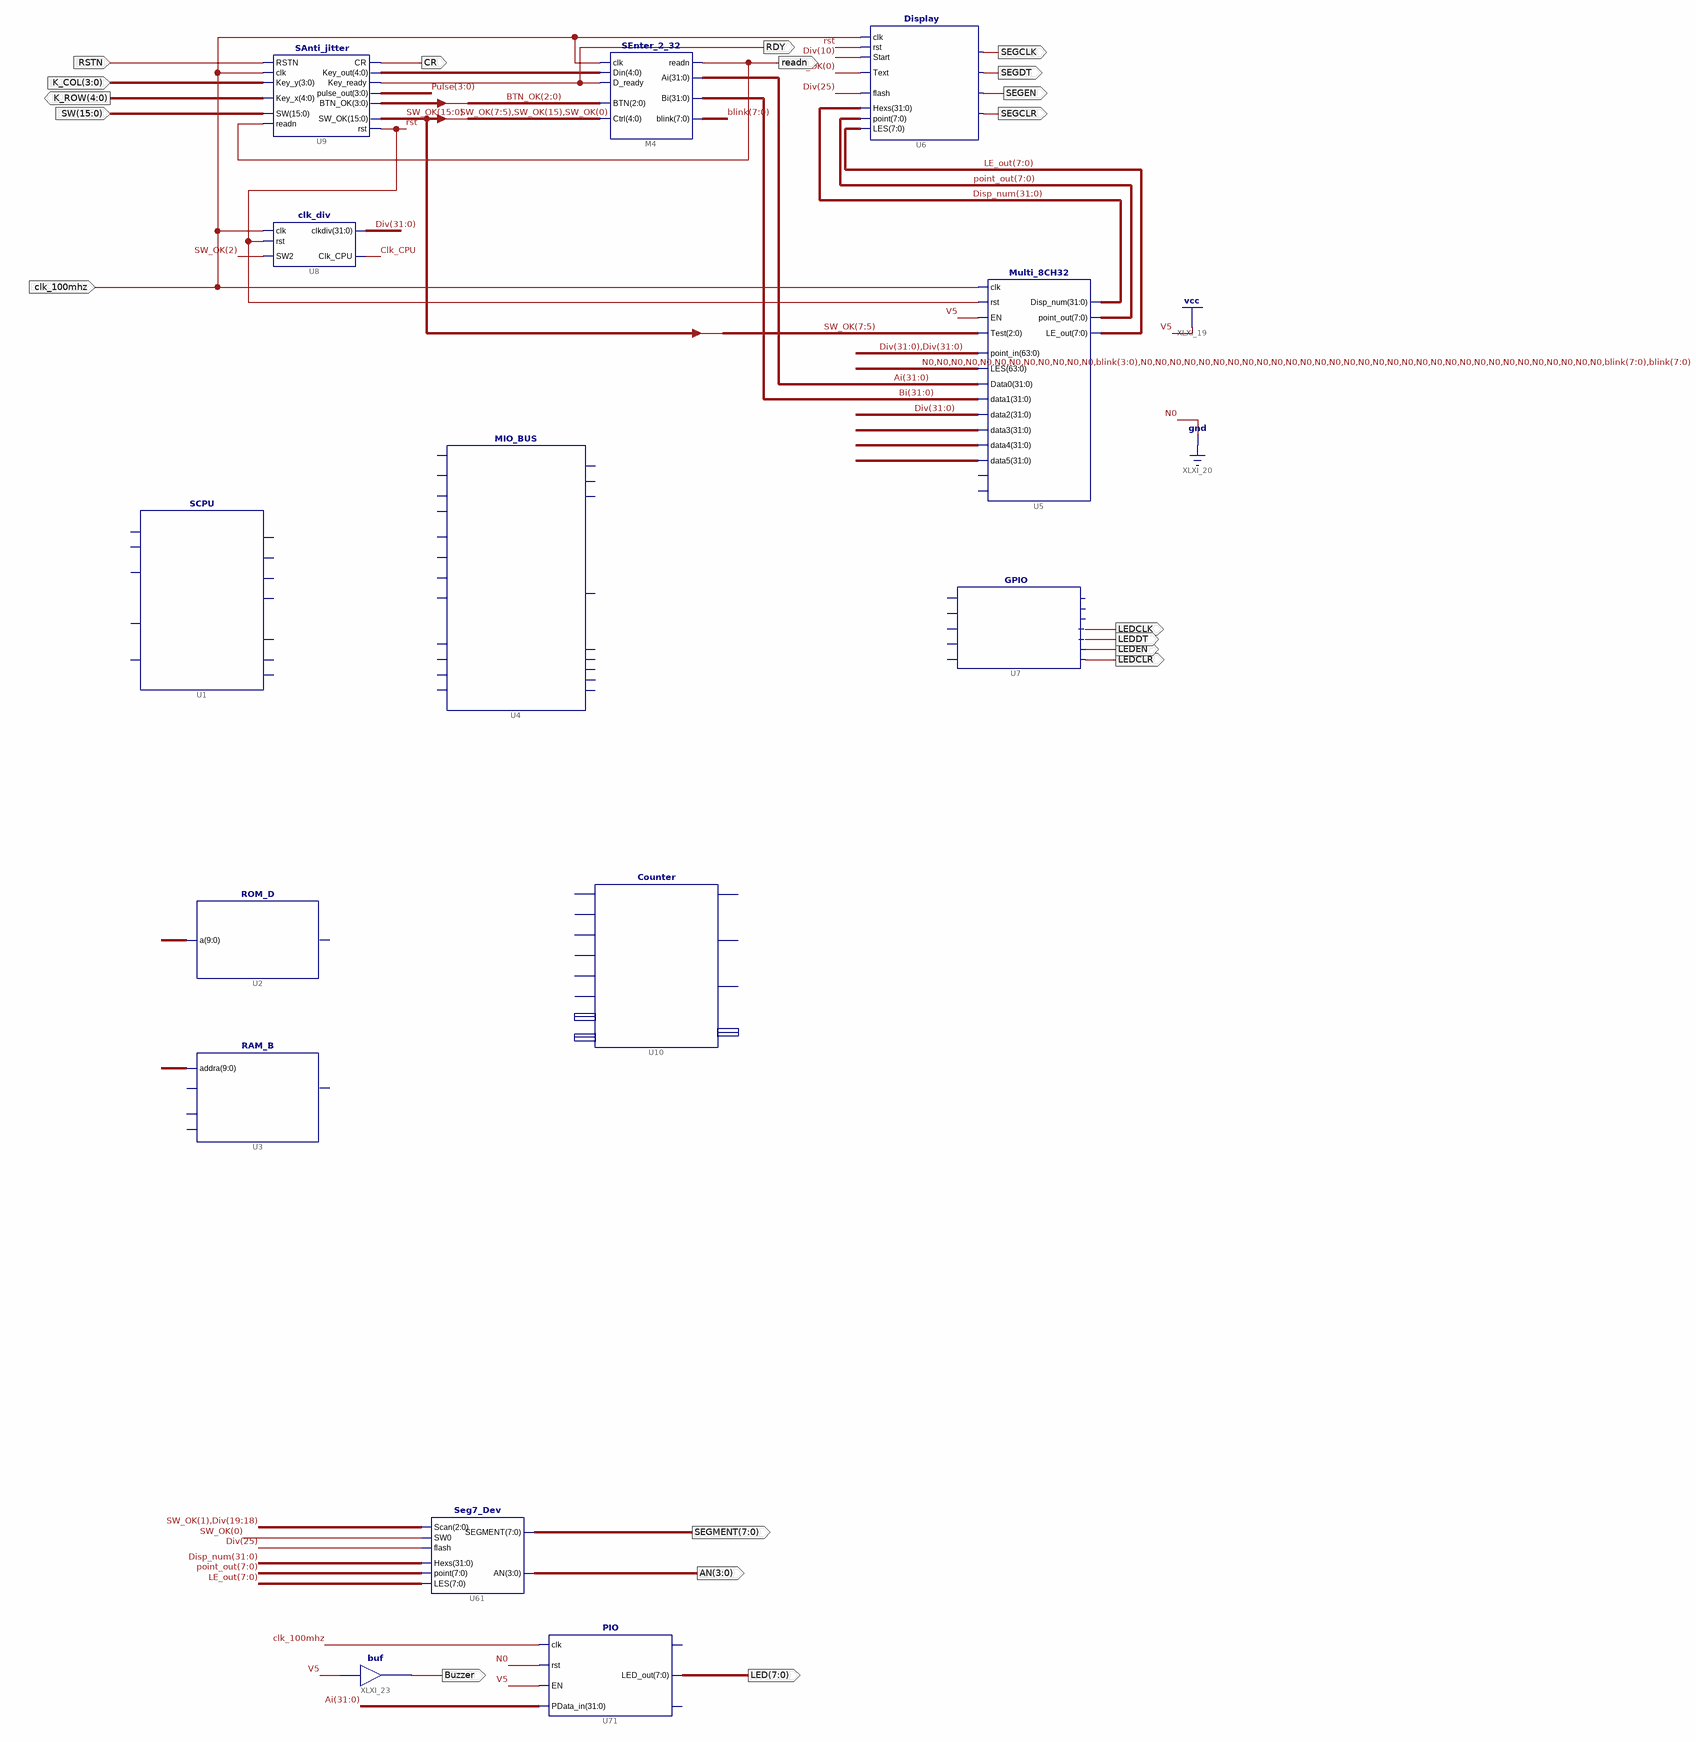
[diagram p0: schematic sheet 1]
// Xilinx ISE schematic OExp01.sch (kintex7) as structural Verilog: 14 symbols, 20 ports
module OExp01 (
  input  RSTN,
  input  [3:0] K_COL,
  input  [15:0] SW,
  input  clk_100mhz,
  output [4:0] K_ROW,
  output readn,
  output CR,
  output RDY,
  output SEGCLK,
  output SEGDT,
  output SEGEN,
  output SEGCLR,
  output LEDCLR,
  output LEDEN,
  output LEDDT,
  output LEDCLK,
  output [7:0] SEGMENT,
  output [3:0] AN,
  output Buzzer,
  output [7:0] LED
);

  wire Clk_CPU, rst;
  wire [3:0] BTN_OK, Pulse;
  wire [4:0] XLXN_15;
  wire [7:0] blink, LE_out, point_out;
  wire [15:0] SW_OK;
  wire [31:0] Ai, Bi, Disp_num, Div, XLXN_47, XLXN_48, XLXN_49;

  Multi_8CH32 U5 (
    .Test(SW_OK[7:5]), .point_in({Div, Div}), .EN(1'b1), .clk(clk_100mhz), .rst(rst),
    .LES({{12{1'b0}}, blink[3:0], {32{1'b0}}, blink, blink}), .Data0(Ai), .data1(Bi), .data2(Div),
    .data3(XLXN_47), .data4(XLXN_48), .data5(XLXN_49), .point_out(point_out), .LE_out(LE_out),
    .Disp_num(Disp_num));  // open: data6, data7
  SEnter_2_32 #(.VeriModel("SEnter_2_32")) M4 (
    .readn(readn), .Ai(Ai), .Bi(Bi), .blink(blink), .Din(XLXN_15), .D_ready(RDY), .clk(clk_100mhz),
    .Ctrl({SW_OK[7:5], SW_OK[15], SW_OK[0]}), .BTN(BTN_OK[2:0]));
  SAnti_jitter #(.VeriModel("SAnti_jitter")) U9 (
    .SW(SW), .readn(readn), .Key_y(K_COL), .Key_x(K_ROW), .RSTN(RSTN), .clk(clk_100mhz), .Key_out(XLXN_15),
    .Key_ready(RDY), .CR(CR), .rst(rst), .SW_OK(SW_OK), .pulse_out(Pulse), .BTN_OK(BTN_OK));
  clk_div U8 (.rst(rst), .clk(clk_100mhz), .SW2(SW_OK[2]), .clkdiv(Div), .Clk_CPU(Clk_CPU));
  Display U6 (
    .LES(LE_out), .point(point_out), .Hexs(Disp_num), .Text(SW_OK[0]), .flash(Div[25]), .clk(clk_100mhz),
    .rst(rst), .Start(Div[10]));  // open: SEGEN, segsout, segclrn, segclk
  GPIO U7 ();  // open: clk, P_Data, rst, EN, Start, ledclk, GPIOf0, LED_out, counter_set, ledclrn, LEDEN, ledsout
  Seg7_Dev U61 (
    .LES(LE_out), .Scan({SW_OK[1], Div[19:18]}), .SEGMENT(SEGMENT), .AN(AN), .point(point_out),
    .flash(Div[25]), .SW0(SW_OK[0]), .Hexs(Disp_num));
  buf XLXI_23 (Buzzer, 1'b1);
  PIO U71 (.clk(clk_100mhz), .rst(1'b0), .EN(1'b1), .PData_in(Ai), .LED_out(LED));  // open: GPIOf0, counter_set
  RAM_B U3 (.addra({{5{1'b0}}, SW[3], Div[27:24]}));  // open: clka, wea, dina, douta
  ROM_D U2 (.a({{5{1'b0}}, SW[3], Div[27:24]}));  // open: spo
  Counter U10 ();  // open: clk, rst, clk0, clk1, clk2, counter_we, counter_val, counter_ch, counter0_OUT, counter1_OUT, counter2_OUT, counter_out
  MIO_BUS U4 ();  // open: rst, clk, mem_w, addr_bus, Cpu_data4bus, Cpu_data2bus, ram_data_out, ram_addr, data_ram_we, ram_data_in, counter_out, counter2_out, counter1_out, counter0_out, counter_we, BTN, SW, led_out, Peripheral_in, GPIOe0000000_we, GPIOf0000000_we
  SCPU U1 ();  // open: clk, reset, inst_in, INT, Addr_out, WR, Data_out, Data_in, PC_out, CPU_MIO, MIO_ready, ALE
endmodule
